# Altium schematic sheet PROB_S7CAS_BilanPuissance.SchDoc
size Tabloid; SheetNumber: 4; SheetTotal: 15; Sheet_Name: Bilan de puissance; Size: 11x17
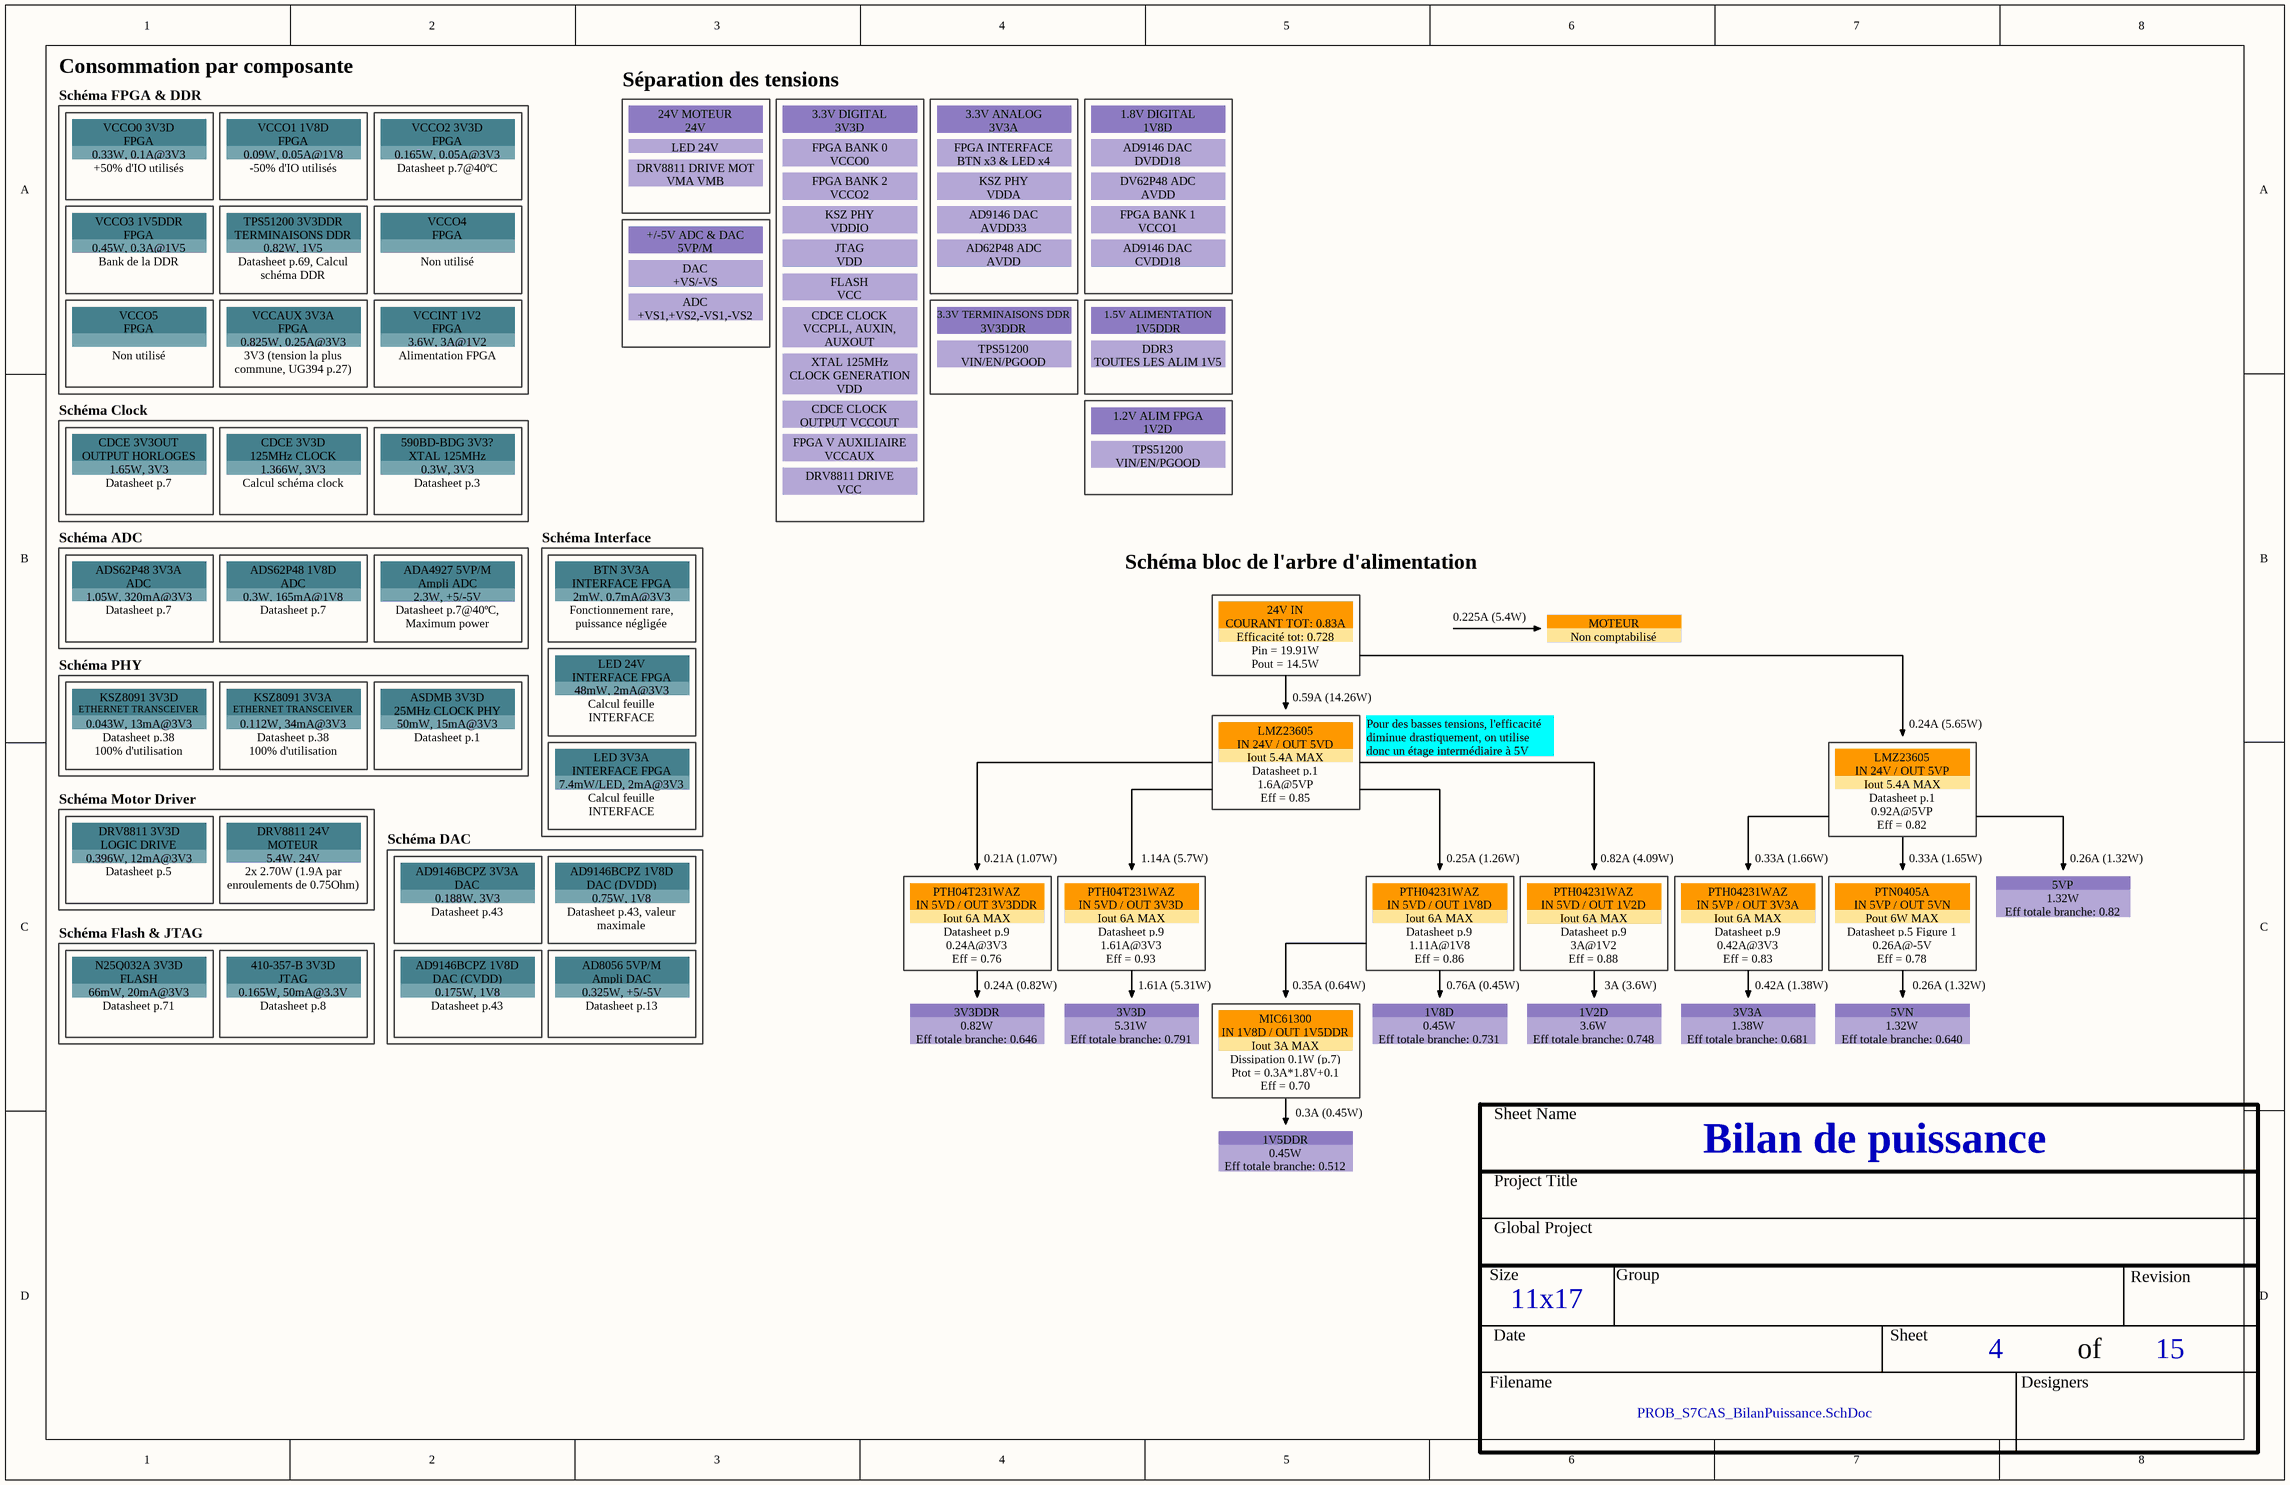
[diagram p0: PROB_S7CAS_BilanPuissance.SchDoc]

## Notes on the sheet
- Consommation par composante
- Séparation des tensions
- Schéma FPGA & DDR
- VCCO0 3V3D
- FPGA
- 0.33W, 0.1A@3V3
- VCCO1 1V8D
- 0.09W, 0.05A@1V8
- VCCO2 3V3D
- 0.165W, 0.05A@3V3
- 24V MOTEUR
- 24V
- LED 24V
- DRV8811 DRIVE MOT
- 3.3V DIGITAL
- 3V3D
- FPGA BANK 0
- VCCO0
- 3.3V ANALOG
- 3V3A
- FPGA INTERFACE
- BTN x3 & LED x4
- 1.8V DIGITAL
- 1V8D
- AD9146 DAC
- DVDD18
- +50% d'IO utilisés
- VCCO3 1V5DDR
- -50% d'IO utilisés
- TPS51200 3V3DDR
- Datasheet p.7@40ºC
- VCCO4
- VMA VMB
- Ptot: 5.47W
- FPGA BANK 2
- VCCO2
- KSZ PHY
- VDDIO
- VDDA
- AVDD33
- DV62P48 ADC
- AVDD
- FPGA BANK 1
- VCCO1
- 0.45W, 0.3A@1V5
- Bank de la DDR
- TERMINAISONS DDR
- 0.82W, 1V5
- Datasheet p.69, Calcul schéma DDR
- Non utilisé
- +/-5V ADC & DAC
- 5VP/M
- DAC
- +VS/-VS
- ADC
- JTAG
- VDD
- FLASH
- VCC
- AD62P48 ADC
- Ptot: 1.38W
- CVDD18
- Ptot: 0.45W
- VCCO5
- VCCAUX 3V3A
- 0.825W, 0.25A@3V3
- VCCINT 1V2
- 3.6W, 3A@1V2
- +VS1,+VS2,-VS1,-VS2
- Ptot: 2.63W
- XTAL 125MHz
- CDCE CLOCK
- VCCPLL, AUXIN, AUXOUT
- 3.3V TERMINAISONS DDR
- 3V3DDR
- TPS51200
- VIN/EN/PGOOD
- 1.5V ALIMENTATION DDR
- 1V5DDR
- DDR3
- TOUTES LES ALIM 1V5
- Schéma Clock
- 3V3 (tension la plus commune, UG394 p.27)
- Alimentation FPGA
- CLOCK GENERATION VDD
- OUTPUT VCCOUT
- Ptot: 0.82W
- 1.2V ALIM FPGA
- 1V2D
- CDCE 3V3OUT
- OUTPUT HORLOGES
- 1.65W, 3V3
- CDCE 3V3D
- 125MHz CLOCK
- 1.366W, 3V3
- 590BD-BDG 3V3?
- 0.3W, 3V3
- FPGA V AUXILIAIRE
- VCCAUX
- DRV8811 DRIVE
- Ptot: 3.60W
- Schéma ADC
- ADS62P48 3V3A
- Datasheet p.7
- ADS62P48 1V8D
- Calcul schéma clock
- ADA4927 5VP/M
- Datasheet p.3
- Schéma Interface
- BTN 3V3A
- Ptot: 5.31W
- Schéma bloc de l'arbre d'alimentation
- 1.05W, 320mA@3V3
- 0.3W, 165mA@1V8
- Ampli ADC
- Datasheet p.7@40ºC, Maximum power
- 2.3W, +5/-5V
- INTERFACE FPGA
- 2mW, 0.7mA@3V3
- Fonctionnement rare, puissance négligée
- 24V IN
- COURANT TOT: 0.83A
- 0.225A (5.4W)
- MOTEUR
- Schéma PHY
- KSZ8091 3V3D
- KSZ8091 3V3A
- ASDMB 3V3D
- 48mW, 2mA@3V3
- Efficacité tot: 0.728
- Pin = 19.91W
- Pout = 14.5W
- 0.59A (14.26W)
- Non comptabilisé
- ETHERNET TRANSCEIVER
- Datasheet p.38
- 0.043W, 13mA@3V3
- 100% d'utilisation
- 0.112W, 34mA@3V3
- 25MHz CLOCK PHY
- Datasheet p.1
- 50mW, 15mA@3V3
- Calcul feuille INTERFACE
- LED 3V3A
- LMZ23605
- IN 24V / OUT 5VD
- Iout 5.4A MAX
- Pour des basses tensions, l'efficacité diminue drastiquement, on utilise donc un étage intermédiaire à 5V
- 0.24A (5.65W)
- Schéma Motor Driver
- DRV8811 3V3D
- DRV8811 24V
- 7.4mW/LED, 2mA@3V3
- 1.6A@5VP
- Eff = 0.85
- 0.92A@5VP
- Eff = 0.82
- IN 24V / OUT 5VP
- LOGIC DRIVE
- Datasheet p.5
- 0.396W, 12mA@3V3
- 5.4W, 24V
- 2x 2.70W (1.9A par enroulements de 0.75Ohm)
- Schéma DAC
- AD9146BCPZ 3V3A
- 0.188W, 3V3
- AD9146BCPZ 1V8D
- DAC (DVDD)
- 0.75W, 1V8
- PTH04T231WAZ
- 0.21A (1.07W)
- 1.14A (5.7W)
- PTH04231WAZ
- 0.25A (1.26W)
- 0.82A (4.09W)
- 0.33A (1.66W)
- PTN0405A
- 0.33A (1.65W)
- 5VP
- 1.32W
- 0.26A (1.32W)
- Schéma Flash & JTAG
- N25Q032A 3V3D
- 410-357-B 3V3D
- Datasheet p.43
- Datasheet p.43, valeur maximale
- AD8056 5VP/M
- IN 5VD / OUT 3V3DDR
- Iout 6A MAX
- Datasheet p.9
- 0.24A@3V3
- Eff = 0.76
- IN 5VD / OUT 3V3D
- 1.61A@3V3
- Eff = 0.93
- IN 5VD / OUT 1V8D
- 1.11A@1V8
- Eff = 0.86
- 3A@1V2
- Eff = 0.88
- IN 5VD / OUT 1V2D
- IN 5VP / OUT 3V3A
- 0.42A@3V3
- Eff = 0.83
- IN 5VP / OUT 5VN
- Pout 6W MAX
- Datasheet p.5 Figure 1
- 0.26A@-5V
- Eff = 0.78
- Eff totale branche: 0.82
- Datasheet p.71
- 66mW, 20mA@3V3
- Datasheet p.8
- 0.165W, 50mA@3.3V
- DAC (CVDD)
- 0.175W, 1V8
- Ampli DAC
- Datasheet p.13
- 0.325W, +5/-5V
- 0.82W
- 0.24A (0.82W)
- 5.31W
- 1.61A (5.31W)
- MIC61300
- IN 1V8D / OUT 1V5DDR
- 0.35A (0.64W)
- 0.45W
- 0.76A (0.45W)
- 3.6W
- 3A (3.6W)
- 1.38W
- 0.42A (1.38W)
- 5VN
- Eff totale branche: 0.646
- Eff totale branche: 0.791
- Iout 3A MAX
- Dissipation 0.1W (p.7)
- Ptot = 0.3A*1.8V+0.1
- Eff = 0.70
- Eff totale branche: 0.731
- Eff totale branche: 0.748
- Eff totale branche: 0.681
- Eff totale branche: 0.640
- Eff totale branche: 0.512
- 0.3A (0.45W)
- Sheet Name
- Project Title
- Global Project
- Size
- Group
- Revision
- Date
- Sheet
- of
- Filename
- Designers